# EAGLE design DTAG01 (EAGLE 4.15)
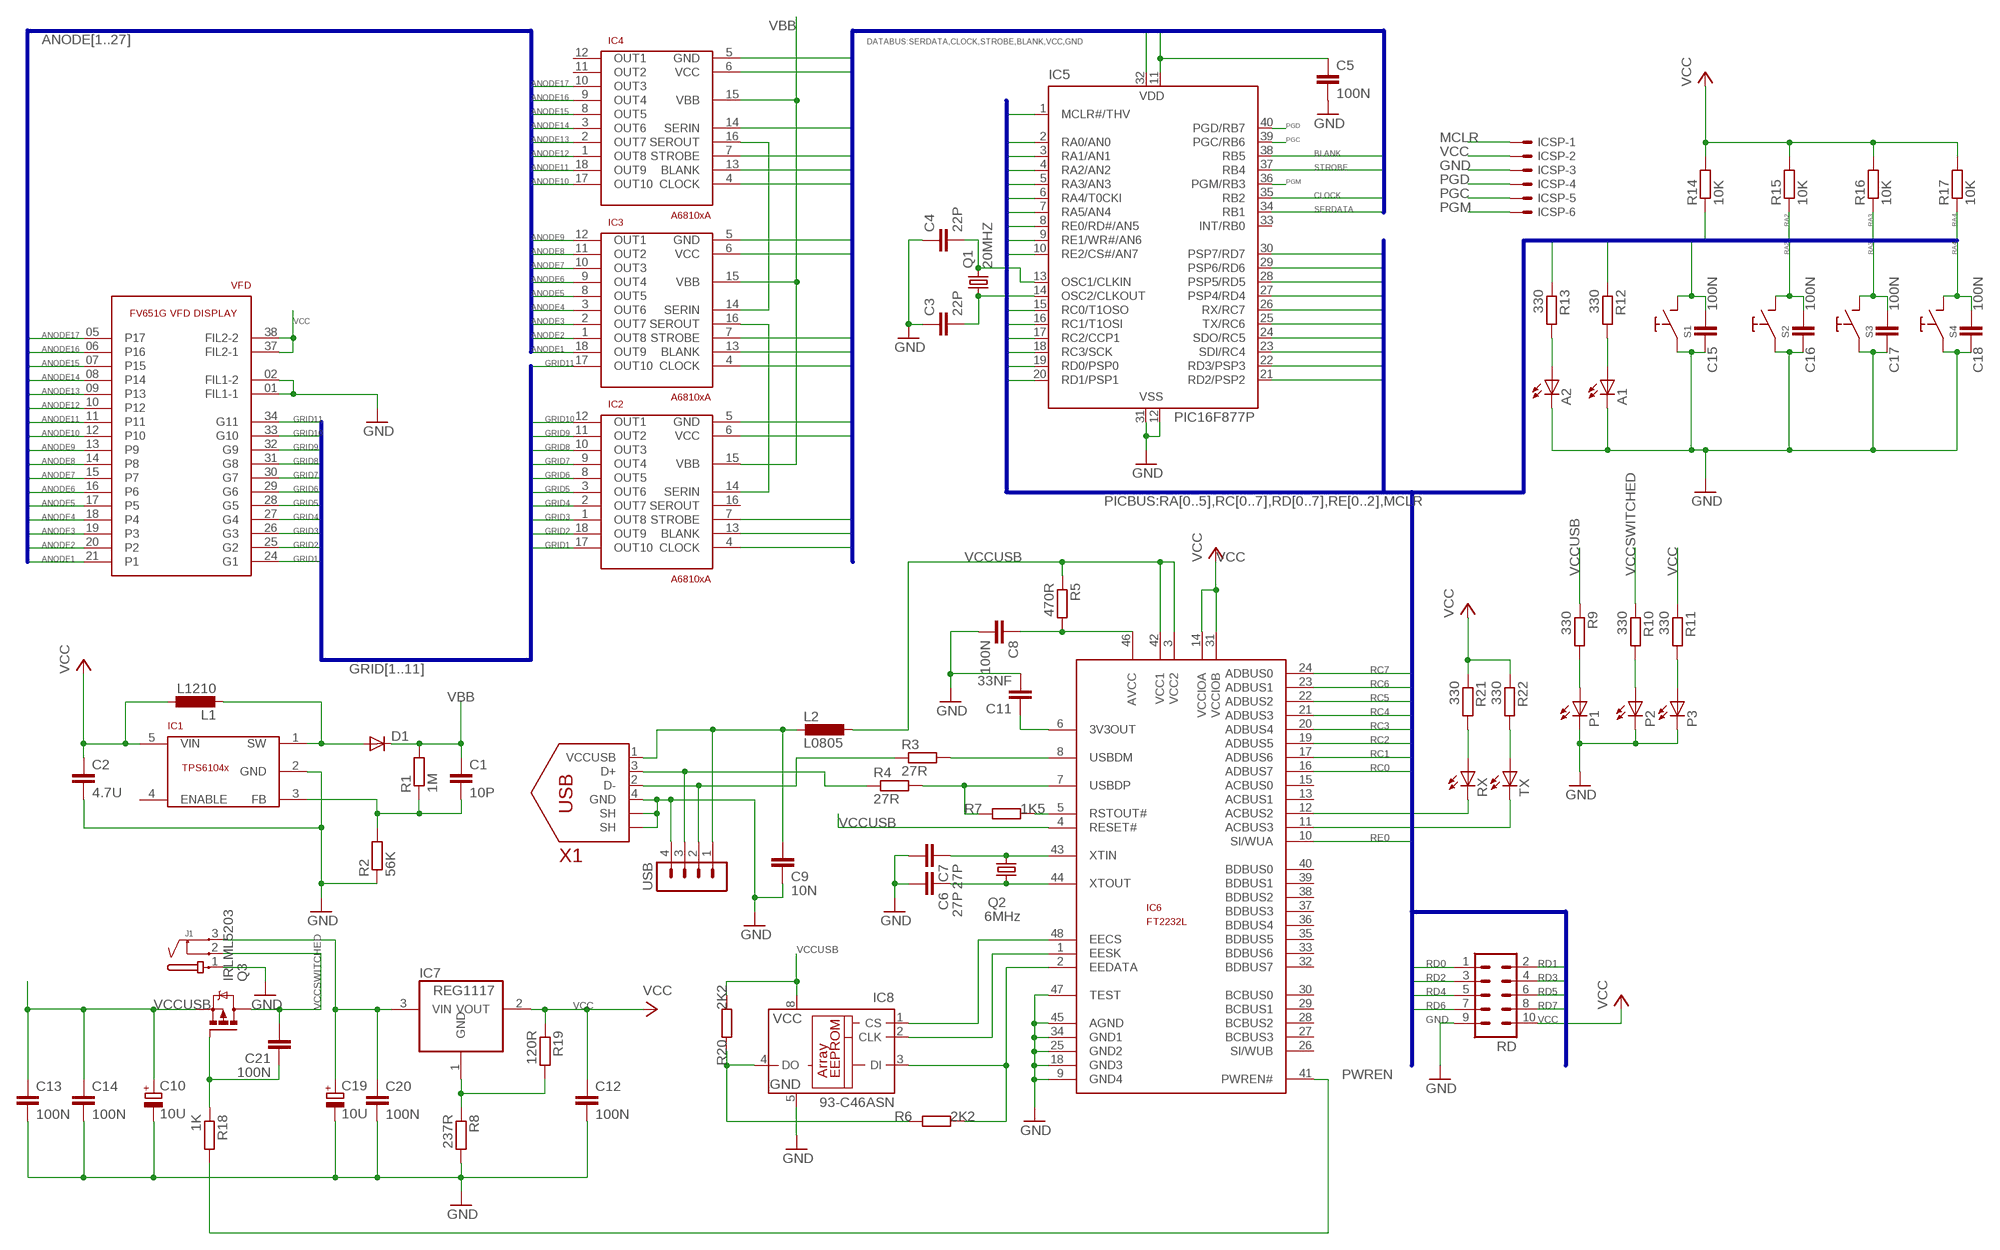
[diagram p0: schematic, sheet 1]

## Parts
A1  LEDCHIP-LED0805  [CHIP-LED0805]
A2  LEDCHIP-LED0805  [CHIP-LED0805]
C1  10P  C-EUC0805K  [C0805K]
C2  4.7U  C-EUC1210  [C1210]
C3  22P  C-EUC0805K  [C0805K]
C4  22P  C-EUC0805K  [C0805K]
C5  100N  C-EUC0805K  [C0805K]
C6  27P  C-EUC0805K  [C0805K]
C7  27P  C-EUC0805K  [C0805K]
C8  100N  C-EUC0805K  [C0805K]
C9  10N  C-EUC0805K  [C0805K]
C10  10U  CPOL-EUSMCD  [SMC_D]
C11  33NF  C-EUC0805K  [C0805K]
C12  100N  C-EUC0805K  [C0805K]
C13  100N  C-EUC0805K  [C0805K]
C14  100N  C-EUC0805K  [C0805K]
C15  100N  C-EUC0805K  [C0805K]
C16  100N  C-EUC0805K  [C0805K]
C17  100N  C-EUC0805K  [C0805K]
C18  100N  C-EUC0805K  [C0805K]
C19  10U  CPOL-EUSMCD  [SMC_D]
C20  100N  C-EUC0805K  [C0805K]
C21  100N  C-EUC0805K  [C0805K]
D1  DIODE-  [POWERMITE]
IC1  TPS6104X  [SOT23-6L]
IC2  A6810  [DIL18]
IC3  A6810  [DIL18]
IC4  A6810  [DIL18]
IC5  PIC16F877P  [DIL40]
IC6  FT2232L  [LQFP48]
IC7  REG1117  [SOT223]
IC8  93-C46ASN  [SO-08]
ICSP  53048-06  [53048-06]
J1  JACK-PMS  [JACK-PMS]
L1  L1210  [C1210]
L2  L0805  [C0805]
P1  LEDCHIP-LED0805  [CHIP-LED0805]
P2  LEDCHIP-LED0805  [CHIP-LED0805]
P3  LEDCHIP-LED0805  [CHIP-LED0805]
Q1  20MHZ  CRYTALHC49S  [HC49/S]
Q2  6MHz  CRYTALHC49S  [HC49/S]
Q3  IRLML5203  [MICRO3]
R1  1M  R-EU_R0805  [R0805]
R2  56K  R-EU_R0805  [R0805]
R3  27R  R-EU_R0805  [R0805]
R4  27R  R-EU_R0805  [R0805]
R5  470R  R-EU_R0805  [R0805]
R6  2K2  R-EU_R0805  [R0805]
R7  1K5  R-EU_R0805  [R0805]
R8  237R  R-EU_R0805  [R0805]
R9  330  R-EU_R0805  [R0805]
R10  330  R-EU_R0805  [R0805]
R11  330  R-EU_R0805  [R0805]
R12  330  R-EU_R0805  [R0805]
R13  330  R-EU_R0805  [R0805]
R14  10K  R-EU_R0805  [R0805]
R15  10K  R-EU_R0805  [R0805]
R16  10K  R-EU_R0805  [R0805]
R17  10K  R-EU_R0805  [R0805]
R18  1K  R-EU_R0805  [R0805]
R19  120R  R-EU_R0805  [R0805]
R20  2K2  R-EU_R0805  [R0805]
R21  330  R-EU_R0805  [R0805]
R22  330  R-EU_R0805  [R0805]
RD  MA05-2  [MA05-2]
RX  LEDCHIP-LED0805  [CHIP-LED0805]
S1  TASTER  [TASTER01]
S2  TASTER  [TASTER01]
S3  TASTER  [TASTER01]
S4  TASTER  [TASTER01]
TX  LEDCHIP-LED0805  [CHIP-LED0805]
USB  MA04-1  [MA04-1]
VFD  FV651G  [FV651G]
X1  USBCONN  [PN61729]

## Nets
ANODE1: IC3.18(OUT9) VFD.21(P1)
ANODE2: IC3.1(OUT8) VFD.20(P2)
ANODE3: IC3.2(OUT7) VFD.19(P3)
ANODE4: IC3.3(OUT6) VFD.18(P4)
ANODE5: IC3.8(OUT5) VFD.17(P5)
ANODE6: IC3.9(OUT4) VFD.16(P6)
ANODE7: IC3.10(OUT3) VFD.15(P7)
ANODE8: IC3.11(OUT2) VFD.14(P8)
ANODE9: IC3.12(OUT1) VFD.13(P9)
ANODE10: IC4.17(OUT10) VFD.12(P10)
ANODE11: IC4.18(OUT9) VFD.11
ANODE12: IC4.1(OUT8) VFD.10(P12)
ANODE13: IC4.2(OUT7) VFD.09(P13)
ANODE14: IC4.3(OUT6) VFD.08(P14)
ANODE15: IC4.8(OUT5) VFD.07(P15)
ANODE16: IC4.9(OUT4) VFD.06(P16)
ANODE17: IC4.10(OUT3) VFD.05(P17)
BLANK: IC2.13(BLANK) IC3.13(BLANK) IC4.13(BLANK) IC5.38(RB5)
CLOCK: IC2.4(CLOCK) IC3.4(CLOCK) IC4.4(CLOCK) IC5.35(RB2)
GND: A1.C A2.C C2.2 C3.1 C4.1 C5.2 C6.2 C7.2 C8.2 C9.1 C10.- C11.2 C12.2 C13.2 C14.2 C15.1 C16.1 C17.1 C18.1 C19.- C20.2 IC1.2(GND) IC2.5(GND) IC3.5(GND) IC4.5(GND) IC5.12(VSS) IC5.31(VSS) IC6.9(GND4) IC6.18(GND3) IC6.25(GND2) IC6.34(GND1) IC6.45(AGND) IC6.47(TEST) IC8.5(GND) ICSP.3 J1.1 P1.C P2.C P3.C R2.1 R8.2 RD.9 S1.S1 S2.S1 S3.S1 S4.S1 USB.4 VFD.01(FIL1-1) VFD.02(FIL1-2) X1.4(GND) X1.SHIELD1(SH) X1.SHIELD2(SH)
GRID1: IC2.17(OUT10) VFD.24(G1)
GRID2: IC2.18(OUT9) VFD.25(G2)
GRID3: IC2.1(OUT8) VFD.26(G3)
GRID4: IC2.2(OUT7) VFD.27(G4)
GRID5: IC2.3(OUT6) VFD.28(G5)
GRID6: IC2.8(OUT5) VFD.29(G6)
GRID7: IC2.9(OUT4) VFD.30(G7)
GRID8: IC2.10(OUT3) VFD.31(G8)
GRID9: IC2.11(OUT2) VFD.32(G9)
GRID10: IC2.12(OUT1) VFD.33(G10)
GRID11: IC3.17(OUT10) VFD.34(G11)
MCLR: C15.2 IC5.1(MCLR#/THV) ICSP.1 R14.1 S1.S2
N$1: IC3.14(SERIN) IC4.16(SEROUT)
N$2: IC2.14(SERIN) IC3.16(SEROUT)
N$3: C4.2 IC5.13(OSC1/CLKIN) Q1.2
N$4: C3.2 IC5.14(OSC2/CLKOUT) Q1.1
N$5: IC6.1(EESK) IC8.2(CLK)
N$6: R4.1 USB.3 X1.3(D+)
N$7: R3.1 USB.2 X1.2(D-)
N$8: IC6.8(USBDM) R3.2
N$9: IC6.7(USBDP) R4.2 R7.1
N$10: IC6.5(RSTOUT#) R7.2
N$11: C7.1 IC6.43(XTIN) Q2.2
N$12: C6.1 IC6.44(XTOUT) Q2.1
N$13: C8.1 IC6.46(AVCC) R5.2
N$14: C21.1 Q3.1(G) R18.1
N$15: C9.2 L2.2 USB.1 X1.1(VCCUSB)
N$16: IC7.1(GND) R8.1 R19.2
N$17: D1.P$1(A) IC1.1(SW) L1.2
N$18: C11.1 IC6.6(3V3OUT)
N$19: A2.A R13.2
N$20: C1.2 IC1.3(FB) R1.1 R2.2
N$21: A1.A R12.2
N$22: P2.A R10.2
N$23: C19.+ C20.1 IC7.3(VIN) J1.3
N$25: P1.A R9.2
N$26: P3.A R11.2
N$27: IC6.48(EECS) IC8.1(CS)
N$28: IC6.2(EEDATA) IC8.3(DI) R6.2
N$29: IC8.4(DO) R6.1 R20.1
N$30: R21.2 RX.A
N$31: R22.2 TX.A
N$32: IC6.12(ACBUS2) RX.C
PGC: IC5.39(PGC/RB6) ICSP.5
PGD: IC5.40(PGD/RB7) ICSP.4
PGM: IC5.36(PGM/RB3) ICSP.6
PWREN: IC6.41(PWREN#) R18.2
RA0: IC5.2(RA0/AN0) R13.1
RA1: IC5.3(RA1/AN1) R12.1
RA2: C16.2 IC5.4(RA2/AN2) R15.1 S2.S2
RA3: C17.2 IC5.5(RA3/AN3) R16.1 S3.S2
RA4: C18.2 IC5.6(RA4/T0CKI) R17.1 S4.S2
RA5: IC5.7(RA5/AN4)
RC0: IC5.15(RC0/T1OSO) IC6.16(ADBUS7)
RC1: IC5.16(RC1/T1OSI) IC6.17(ADBUS6)
RC2: IC5.17(RC2/CCP1) IC6.19(ADBUS5)
RC3: IC5.18(RC3/SCK) IC6.20(ADBUS4)
RC4: IC5.23(SDI/RC4) IC6.21(ADBUS3)
RC5: IC5.24(SDO/RC5) IC6.22(ADBUS2)
RC6: IC5.25(TX/RC6) IC6.23(ADBUS1)
RC7: IC5.26(RX/RC7) IC6.24(ADBUS0)
RD0: IC5.19(RD0/PSP0) RD.1
RD1: IC5.20(RD1/PSP1) RD.2
RD2: IC5.21(RD2/PSP2) RD.3
RD3: IC5.22(RD3/PSP3) RD.4
RD4: IC5.27(PSP4/RD4) RD.5
RD5: IC5.28(PSP5/RD5) RD.6
RD6: IC5.29(PSP6/RD6) RD.7
RD7: IC5.30(PSP7/RD7) RD.8
RE0: IC5.8(RE0/RD#/AN5) IC6.10(SI/WUA)
RE1: IC5.9(RE1/WR#/AN6)
RE2: IC5.10(RE2/CS#/AN7)
SERDATA: IC4.14(SERIN) IC5.34(RB1)
STROBE: IC2.7(STROBE) IC3.7(STROBE) IC4.7(STROBE) IC5.37(RB4)
TX: IC6.11(ACBUS3) TX.C
VBB: C1.1 D1.P$2(C) IC2.15(VBB) IC3.15(VBB) IC4.15(VBB) R1.2
VCC: C2.1 C5.1 C12.1 IC1.5(VIN) IC2.6(VCC) IC3.6(VCC) IC4.6(VCC) IC5.11(VDD) IC5.32(VDD) IC6.14(VCCIOA) IC6.31(VCCIOB) IC7.2(VOUT) ICSP.2 L1.1 R11.1 R14.2 R15.2 R16.2 R17.2 R19.1 R21.1 R22.1 RD.10 VFD.37(FIL2-1) VFD.38(FIL2-2)
VCCSWITCHED: C21.2 J1.2 Q3.3(D) R10.1
VCCUSB: C10.+ C13.1 C14.1 IC6.3(VCC2) IC6.4(RESET#) IC6.42(VCC1) IC8.8(VCC) L2.1 Q3.2(S) R5.1 R9.1 R20.2
Unconnected: IC1.4(ENABLE) IC2.16(SEROUT) IC4.11(OUT2) IC4.12(OUT1) IC5.33(INT/RB0) IC6.13(ACBUS1) IC6.15(ACBUS0) IC6.26(SI/WUB) IC6.27(BCBUS3) IC6.28(BCBUS2) IC6.29(BCBUS1) IC6.30(BCBUS0) IC6.32(BDBUS7) IC6.33(BDBUS6) IC6.35(BDBUS5) IC6.36(BDBUS4) IC6.37(BDBUS3) IC6.38(BDBUS2) IC6.39(BDBUS1) IC6.40(BDBUS0)

## Buses
GRID[1..11]
ANODE[1..27]
DATABUS:SERDATA,CLOCK,STROBE,BLANK,VCC,GND
PICBUS:RA[0..5],RC[0..7],RD[0..7],RE[0..2],MCLR

## Library data of the parts
A1 A2 P1-P3 RX TX = led:LED: LED OSRAM: - CHIPLED LG R971, LG N971, LY N971, LG Q971, LY Q971, LO R971, LY R971 LH N974, LH R974 LS Q976, LO Q976, LY Q976 LO Q996 - Hyper CHIPLED LW Q18S LB Q993, LB Q99A, LB R99A - SideLED LS A670, LO A670, LY A670, LG A670, LP A670 LB A673, LV A673, LT A673, LW A673 LH A674 LY A675 LS A676, LA A676, LO A676, LY A676, LW A676 LS A679, LY A679, LG A679 - Hyper Micro SIDELED® LS Y876, LA Y876, LO Y876, LY Y876 LT Y87S - SmartLED LW L88C, LW L88S LB L89C, LB L89S, LG L890 LS L89K, LO L89K, LY L89K LS L896, LA L896, LO L896, LY L896 - TOPLED LS T670, LO T670, LY T670, LG T670, LP T670 LSG T670, LSP T670, LSY T670, LOP T670, LYG T670 LG T671, LOG T671, LSG T671 LB T673, LV T673, LT T673, LW T673 LH T674 LS T676, LA T676, LO T676, LY T676, LB T676, LH T676, LSB T676, LW T676 LB T67C, LV T67C, LT T67C, LS T67K, LO T67K, LY T67K, LW E67C LS E67B, LA E67B, LO E67B, LY E67B, LB E67C, LV E67C, LT E67C LW T67C LS T679, LY T679, LG T679 LS T770, LO T770, LY T770, LG T770, LP T770 LB T773, LV T773, LT T773, LW T773 LH T774 LS E675, LA E675, LY E675, LS T675 LS T776, LA T776, LO T776, LY T776, LB T776 LHGB T686 LT T68C, LB T68C - Hyper Mini TOPLED® LB M676 - Mini TOPLED Santana® LG M470 LS M47K, LO M47K, LY M47K Source: http://www.osram.convergy.de/
C1 C3-C9 C11-C18 C20 C21 = rcl:C-EU: CAPACITOR, European symbol
C2 = turbod3:C-EU: CAPACITOR, European symbol
C10 C19 = rcl:CPOL-EU: POLARIZED CAPACITOR, European symbol
D1 = diode:DIODE-: DIODE
IC1 = turbod3:TPS6104X
IC2-IC4 = turbod3:A6810
IC5 = microchip:PIC16F87*: MICROCONTROLLER
IC6 = turbod3:FT2232L
IC7 = burr-brown:REG1117: 800mA and 1A Low Dropout (LDO) Positive Regulator 1.8V, 2.5V, 2.85V, 3.3V, 5V, and Adj
IC8 = microchip:93-*: Serial EEPROM 512 x 8 bit/256 x 16 bit/1 K/4 K, 5.0 V, Microwire
ICSP = con-molex:53?-06: CONNECTOR wire to board 1.25 mm (.049 inch) pitch header
J1 = POWER-IN:JACK-PMS
L1 L2 = turbod3:L
Q1 Q2 = turbod3:CRYTAL: CRYSTAL
Q3 = transistor-power:IRLML5203: HEXFET P-Channel Power MOSFET
R1-R22 = rcl:R-EU_: RESISTOR, European symbol
RD = con-lstb:MA05-2: PIN HEADER
S1-S4 = turbod3:TASTER
USB = con-lstb:MA04-1: PIN HEADER
VFD = turbod3:FV651G
X1 = turbod3:USBCONN

## Net classes
0 default: width 0.25 mm, drill 0.006 mm

## Board
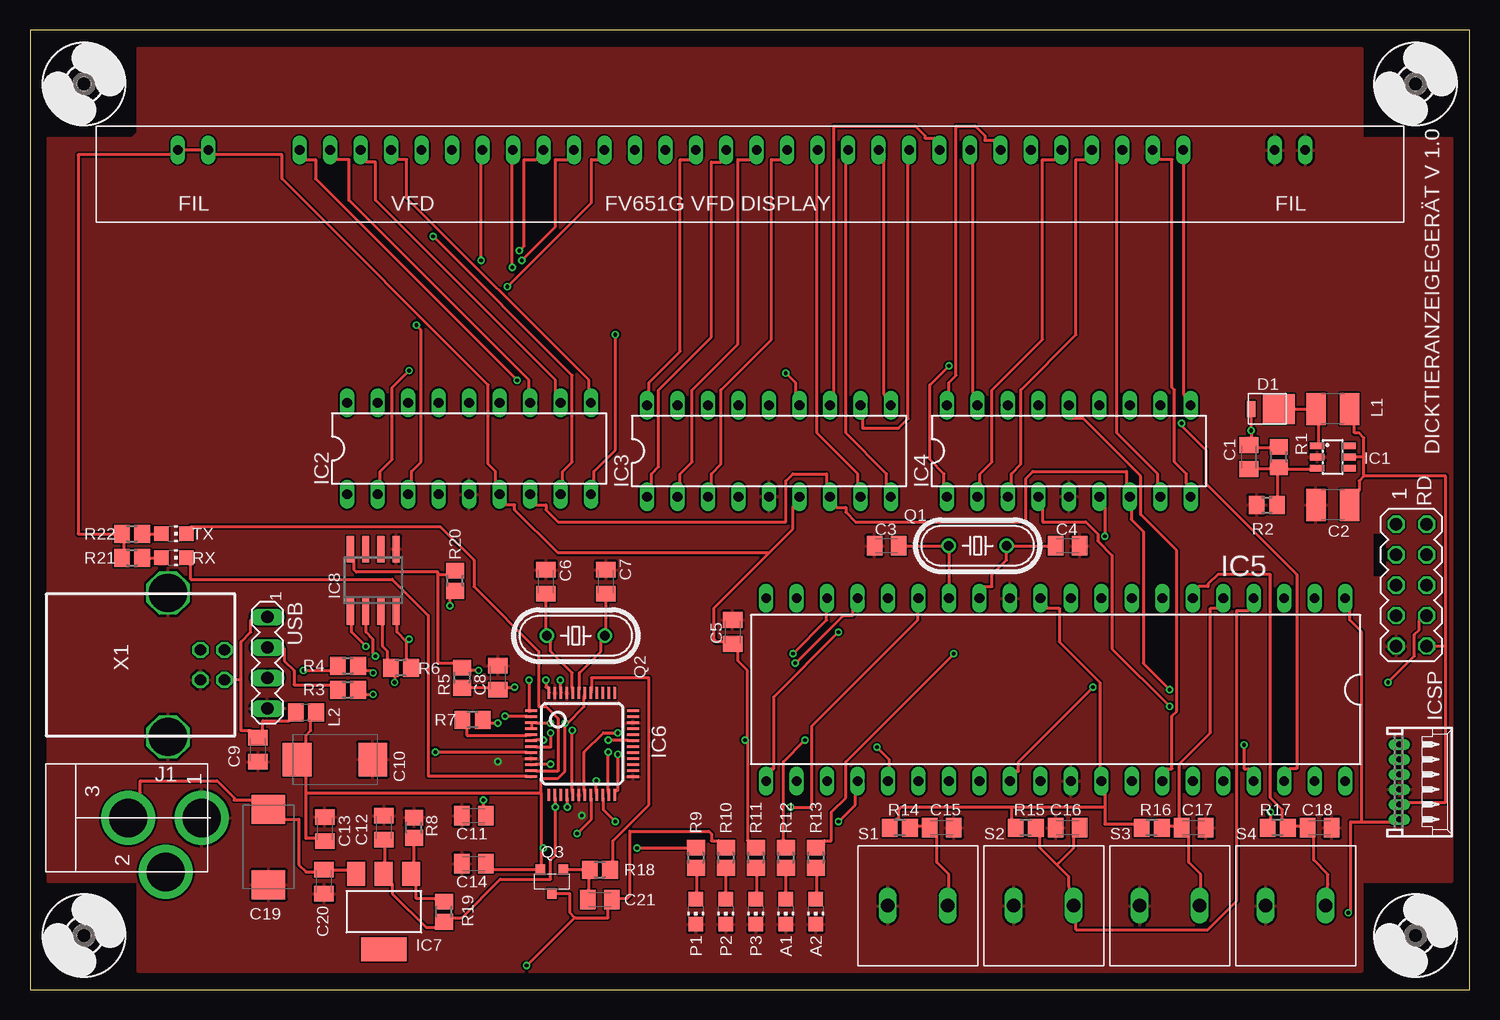
[diagram p1: board, top side]
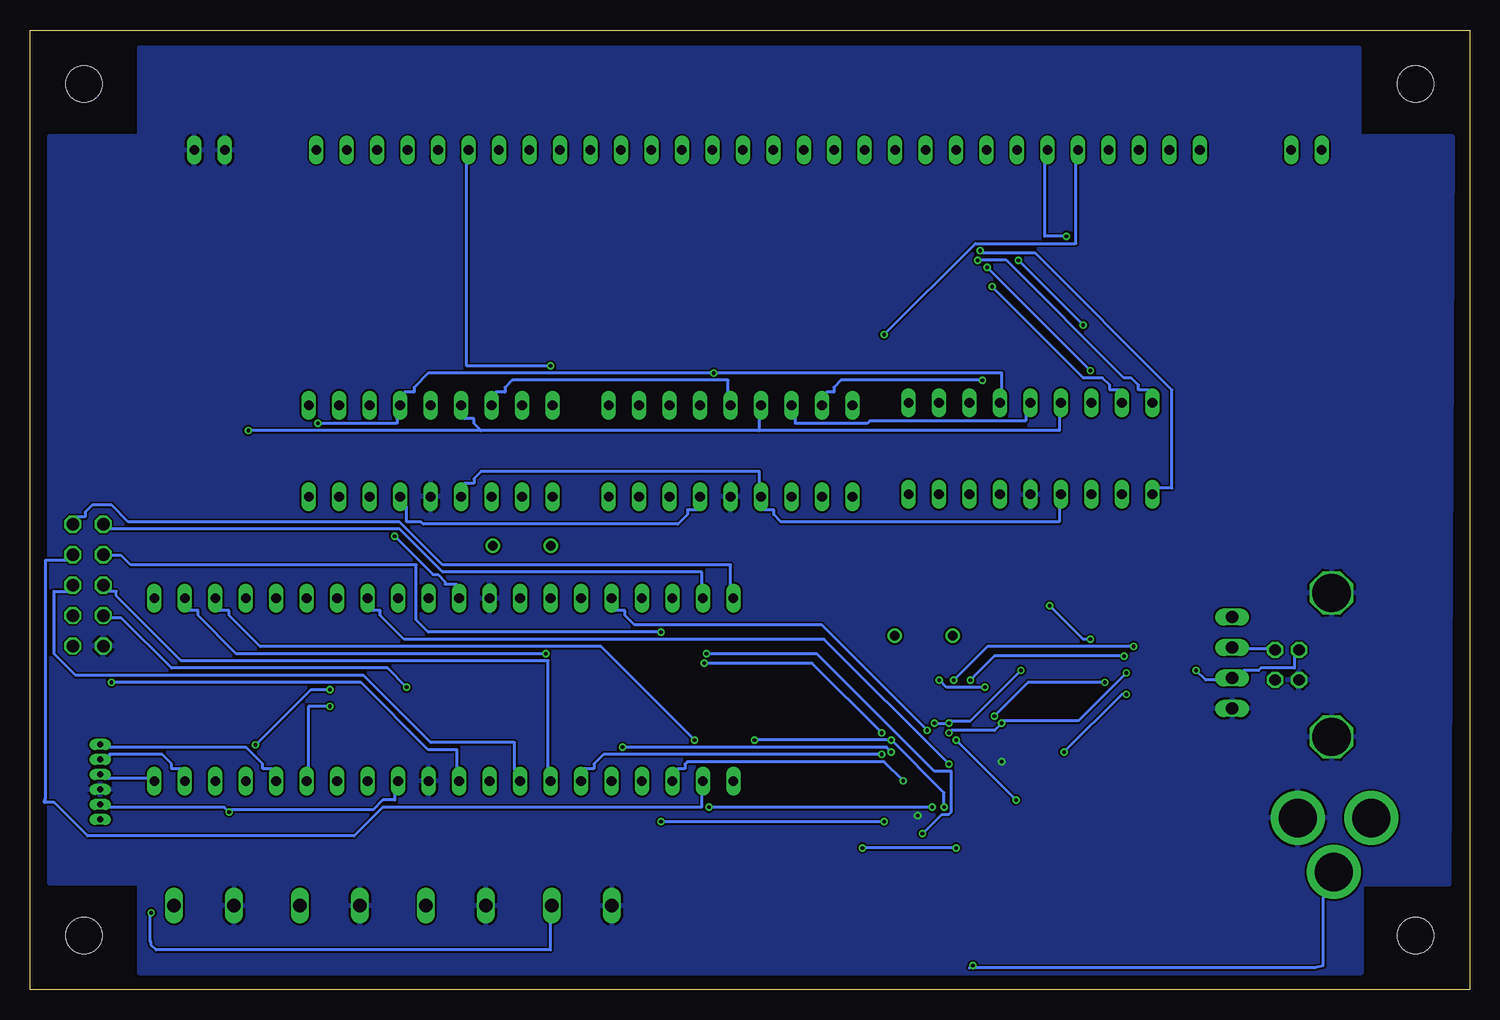
[diagram p2: board, bottom side, seen from below]

Size 120 x 80 mm. Coordinates in mm from the lower left corner, seen from the top.
Outline: 0,0 120,0 120,80 0,80 0,0
Copper layers (1*16): Top 0.035mm / dielectric 1.5mm / Bottom 0.035mm
Design rules "PCB-POOL": minimum track width 6mil, minimum drill 12mil, track to track 6mil, track to pad 6mil, pad to pad 6mil, via to via 6mil, smd to smd 6mil, copper to edge 20mil, drill to drill 8mil, minimum pad ring 8mil, minimum via ring 6mil, stop-mask expansion 3mil, vias tented up to drill 0mil, thermal gap 8mil
tRestrict: area 112,34.5 to 113,38

### Footprints (pad centres in the part's own frame; a part is rotated, then mirrored left to right if it is on the bottom)
CHIP-LED0805 = smd 1.2 x 1.2: A 0,-1.05; C 0,1.05
C0805K = smd 1.3 x 1.6: 1 -1,0; 2 1,0
C1210 = smd 1.6 x 2.7: 1 -1.4,0; 2 1.4,0
SMC_D = smd 2.4 x 2.8: + -3.15,0; - 3.15,0
POWERMITE = smd 2.7 x 2.5: P$1 0,0 | smd 0.7 x 1.3: P$2 2.3,0
SOT23-6L = smd 0.55 x 1.2: 1 -0.95,-1.3; 2 0,-1.3; 3 0.95,-1.3; 4 0.95,1.3; 5 0,1.3; 6 -0.95,1.3
DIL18 = drill 0.813 long: 1 -10.16,-3.81; 2 -7.62,-3.81; 3 -5.08,-3.81; 4 -2.54,-3.81; 5 0,-3.81; 6 2.54,-3.81; 7 5.08,-3.81; 8 7.62,-3.81; 9 10.16,-3.81; 10 10.16,3.81; 11 7.62,3.81; 12 5.08,3.81; 13 2.54,3.81; 14 0,3.81; 15 -2.54,3.81; 16 -5.08,3.81; 17 -7.62,3.81; 18 -10.16,3.81
DIL40 = drill 0.813 long: 1 -24.13,-7.62; 2 -21.59,-7.62; 3 -19.05,-7.62; 4 -16.51,-7.62; 5 -13.97,-7.62; 6 -11.43,-7.62; 7 -8.89,-7.62; 8 -6.35,-7.62; 9 -3.81,-7.62; 10 -1.27,-7.62; 11 1.27,-7.62; 12 3.81,-7.62; 13 6.35,-7.62; 14 8.89,-7.62; 15 11.43,-7.62; 16 13.97,-7.62; 17 16.51,-7.62; 18 19.05,-7.62; 19 21.59,-7.62; 20 24.13,-7.62; 21 24.13,7.62; 22 21.59,7.62; 23 19.05,7.62; 24 16.51,7.62; 25 13.97,7.62; 26 11.43,7.62; 27 8.89,7.62; 28 6.35,7.62; 29 3.81,7.62; 30 1.27,7.62; 31 -1.27,7.62; 32 -3.81,7.62; 33 -6.35,7.62; 34 -8.89,7.62; 35 -11.43,7.62; 36 -13.97,7.62; 37 -16.51,7.62; 38 -19.05,7.62; 39 -21.59,7.62; 40 -24.13,7.62
LQFP48 = smd 0.2 x 1: 1 -2.75,-4.25; 2 -2.25,-4.25; 3 -1.75,-4.25; 4 -1.25,-4.25; 5 -0.75,-4.25; 6 -0.25,-4.25; 7 0.25,-4.25; 8 0.75,-4.25; 9 1.25,-4.25; 10 1.75,-4.25; 11 2.25,-4.25; 12 2.75,-4.25; 25 2.75,4.25; 26 2.25,4.25; 27 1.75,4.25; 28 1.25,4.25; 29 0.75,4.25; 30 0.25,4.25; 31 -0.25,4.25; 32 -0.75,4.25; 33 -1.25,4.25; 34 -1.75,4.25; 35 -2.25,4.25; 36 -2.75,4.25 | smd 1 x 0.2: 13 4.25,-2.75; 14 4.25,-2.25; 15 4.25,-1.75; 16 4.25,-1.25; 17 4.25,-0.75; 18 4.25,-0.25; 19 4.25,0.25; 20 4.25,0.75; 21 4.25,1.25; 22 4.25,1.75; 23 4.25,2.25; 24 4.25,2.75; 37 -4.25,2.75; 38 -4.25,2.25; 39 -4.25,1.75; 40 -4.25,1.25; 41 -4.25,0.75; 42 -4.25,0.25; 43 -4.25,-0.25; 44 -4.25,-0.75; 45 -4.25,-1.25; 46 -4.25,-1.75; 47 -4.25,-2.25; 48 -4.25,-2.75
SOT223 = smd 1.499 x 2.007: 1 -2.261,-3.15; 2 0.025,-3.15; 3 2.311,-3.15 | smd 3.81 x 2.007: 4 0,3.15
SO-08 = smd 0.6 x 2.2: 1 -1.905,-2.6; 2 -0.635,-2.6; 3 0.635,-2.6; 4 1.905,-2.6; 5 1.905,2.6; 6 0.635,2.6; 7 -0.635,2.6; 8 -1.905,2.6
53048-06 = drill 0.5 pad 0.698 long: 1 3.125,-1.25; 2 1.875,-1.25; 3 0.625,-1.25; 4 -0.625,-1.25; 5 -1.875,-1.25; 6 -3.125,-1.25
JACK-PMS = drill 3.2 pad 4.5 round: 1 -0.5,-3.31; 2 -5,-0.31; 3 -0.5,2.809
C0805 = smd 1.3 x 1.5: 1 -0.85,0; 2 0.85,0
HC49/S = drill 0.813 round: 1 -2.413,0; 2 2.413,0
MICRO3 = smd 0.8 x 0.9: 1 -0.95,-1; 2 0.95,-1; 3 0,1
R0805 = smd 1.3 x 1.5: 1 -0.85,0; 2 0.85,0
MA05-2 = drill 1.016 octagon: 1 -5.08,-1.27; 2 -5.08,1.27; 3 -2.54,-1.27; 4 -2.54,1.27; 5 0,-1.27; 6 0,1.27; 7 2.54,-1.27; 8 2.54,1.27; 9 5.08,-1.27; 10 5.08,1.27
TASTER01 = drill 1.1 long: S1 -2.5,0; S2 2.5,0
3,0 = hole 3: 0,0
MA04-1 = drill 1.016 long: 1 -3.81,0; 2 -1.27,0; 3 1.27,0; 4 3.81,0
FV651G = drill 0.8 long: 01 50.8,0; 02 48.26,0; 05 40.64,0; 06 38.1,0; 07 35.56,0; 08 33.02,0; 09 30.48,0; 10 27.94,0; 11 25.4,0; 12 22.86,0; 13 20.32,0; 14 17.78,0; 15 15.24,0; 16 12.7,0; 17 10.16,0; 18 7.62,0; 19 5.08,0; 20 2.54,0; 21 0,0; 22 -2.54,0; 23 -5.08,0; 24 -7.62,0; 25 -10.16,0; 26 -12.7,0; 27 -15.24,0; 28 -17.78,0; 29 -20.32,0; 30 -22.86,0; 31 -25.4,0; 32 -27.94,0; 33 -30.48,0; 34 -33.02,0; 37 -40.64,0; 38 -43.18,0
PN61729 = drill 0.95 octagon: 1 1.25,4.71; 2 -1.25,4.71; 3 -1.25,2.71; 4 1.25,2.71 | drill 3.2 octagon: SHIELD1 -6,0; SHIELD2 6,0

### Placement (x,y rotation side)
A1  63,6.5 180 top
A2  65.5,6.5 180 top
C1  101.6,44.4 270 top
C2  108.6,40.4 180 top
C3  71.4,37 0 top
C4  86.5,37 180 top
C5  58.58,29.81 90 top
C6  43,34 90 top
C7  48,34 90 top
C8  39,26 90 top
C9  19,20 90 top
C10  25.43,19.18 0 top
C11  37,14.5 180 top
C12  29.5,13.5 90 top
C13  24.58,13.39 90 top
C14  37,10.5 180 top
C15  76,13.5 180 top
C16  86.5,13.5 0 top
C17  97,13.5 180 top
C18  107.5,13.5 180 top
C19  19.88,11.88 270 top
C20  24.5,9 270 top
C21  47.5,7.5 0 top
D1  104.1,48.4 180 top
IC1  108.6,44.4 270 top
IC2  36.6,45.1 0 top
IC3  61.6,44.9 0 top
IC4  86.6,44.9 0 top
IC5  85.5,25 180 top
IC6  46,20.5 270 top
IC7  29.5,6.5 180 top
IC8  28.62,34.11 0 top
ICSP  115.4,17.3 270 top
J1  11,14.8 90 top
L1  108.6,48.4 180 top
L2  23,23.1 180 top
P1  55.5,6.5 180 top
P2  58,6.5 180 top
P3  60.5,6.5 180 top
Q1  79,37 0 top
Q2  45.5,29.5 0 top
Q3  43.5,9 180 top
R1  104.1,44.4 90 top
R2  103.1,40.4 0 top
R3  26.5,25 0 top
R4  26.5,27 0 top
R5  36,26 270 top
R6  30.92,26.82 180 top
R7  36.9,22.5 180 top
R8  32,13.5 90 top
R9  55.5,11 270 top
R10  58,11 270 top
R11  60.5,11 270 top
R12  63,11 270 top
R13  65.5,11 270 top
R14  72.5,13.5 180 top
R15  83,13.5 180 top
R16  93.5,13.5 180 top
R17  104,13.5 180 top
R18  47.5,10 0 top
R19  34.5,6.5 90 top
R20  35.44,34.08 90 top
R21  8.5,36 0 top
R22  8.5,38 0 top
RD  115.15,33.71 270 top
RX  12,36 270 top
S1  74,7 0 top
S2  84.5,7 0 top
S3  95,7 0 top
S4  105.5,7 0 top
TX  12,38 270 top
U$1  [3,0]  4.5,75.5 0 top
U$2  [3,0]  115.5,75.5 0 top
U$4  [3,0]  115.5,4.5 0 top
U$5  [3,0]  4.5,4.5 0 top
USB  19.79,27.24 270 top
VFD  55.5,70 0 top
X1  11.5,27.06 270 top

### Tracks (layer width: path | path; a pad name or v marks a point on that pad's centre or on a via)
ANODE1
  Top 0.25: VFD.21 55,69.2 54.2,69.2 54.2,53.2 51.6,50.6 51.6,49.8 IC3.18
ANODE2
  Top 0.25: VFD.20 57.6,69 56.8,69 56.8,54.4 52.4,50 52.4,43.6 51.8,43 51.8,42.2 IC3.1
ANODE3
  Top 0.25: VFD.19 60,69.2 59,69.2 59,53.8 55.2,50 55.2,44 54.2,43 54.2,42.2 IC3.2
ANODE4
  Top 0.25: VFD.18 62.6,69.2 61.8,69.2 61.8,54.2 57.6,50 57.6,43.8 56.8,43 56.8,42.2 IC3.3
ANODE5
  Top 0.25: VFD.17 65.6,68.8 65.6,46.4 69,43 69,42.2 IC3.8
ANODE6
  Top 0.25: VFD.16 68,68.8 68,46.4 71.4,43 71.4,42.2 IC3.9
ANODE7
  Top 0.25: VFD.15 71.2,69.2 71.2,49.6 IC3.10
ANODE8
  Top 0.25: VFD.14 73.2,68.8 73.2,47.6 72.4,46.8 69.4,46.8 69.4,47.6 IC3.11
ANODE9
  Top 0.25: VFD.13 75.4,71 74.6,71 74.6,71.2 73.8,72 67,72 67,49.8 IC3.12
ANODE10
  Top 0.25: VFD.12 78.6,68.8 78.6,49.8 IC4.17
ANODE11
  Top 0.25: VFD.11 80.4,70.8 79.6,70.8 79.6,71.2 78.8,72 77.2,72 77.2,51.2 76.6,50.6 76.6,49.8 IC4.18
ANODE12  (via drill 0.3)
  Top 0.25: v76.6,52 75,50.4 75,44.2 76.2,43 76.2,42.2 IC4.1
  Bottom 0.25: v76.6,52 83.6,52 83.6,68.8 VFD.10
ANODE13
  Top 0.25: VFD.09 85.4,69.2 84.4,69.2 84.4,54.2 80.2,50 80.2,44 79.2,43 79.2,42.2 IC4.2
ANODE14
  Top 0.25: VFD.08 88,69.2 87.2,69.2 87.2,54.6 82.6,50 82.6,43.8 81.8,43 81.8,42.2 IC4.3
ANODE15
  Top 0.25: VFD.07 90.6,69.2 90.6,46.4 94,43 94,42.2 IC4.8
ANODE16
  Top 0.25: VFD.06 94.2,69.2 95.2,69.2 95.2,50.2 95.4,50 95.4,44 96.4,43 96.4,42.2 IC4.9
ANODE17
  Top 0.25: VFD.05 96.2,68.8 96.2,49.6 IC4.10
BLANK  (via drill 0.3)
  Top 0.25: v63,51.4 63.8,50.6 63.8,49.8 IC3.13 | v96,47.2 96,47 98,45 98,42.2 105.6,34.6 105.6,18.4 105,18.4 IC5.38
  Bottom 0.25: IC2.13 39,50 39,51.4 v63,51.4 86.8,51.4 88,50.2 88,49.8 88.8,49.8 IC4.13 89.4,47.6 89.4,47.2 v96,47.2
CLOCK  (via drill 0.3)
  Top 0.25: v95,23.6 90.2,28.4 90.2,36.2 89,37.4 89,38 88,39 84.4,39 84.4,40 IC4.4
  Bottom 0.25: IC2.4 34.2,40.2 34.2,39 57.4,39 58,39.6 58,40 58.8,40 IC3.4 59.2,42.2 59.2,43.2 82.4,43.2 83,42.6 83,42.2 83.8,42.2 IC4.4 | v95,23.6 96.8,23.6 96.8,18.4 IC5.35
GND  (via drill 0.3)
  other vias: 39,19 46,14.5
  pour Top: 1.5,71 8.5,71 9,71.5 9,78.5 111,78.5 111,71 118.5,71 118.5,9 111,9 111,1.5 9,1.5 9,9 1.5,9
  pour Bottom: 9.2,71.1 9.2,78.5 110.9,78.5 110.9,71.1 118.4,71.1 118.4,8.9 110.9,8.9 110.9,1.4 9,1.4 9,8.8 1.7,8.8 1.4,70.8 1.4,71.1
GRID1  (via drill 0.3)
  Top 0.25: v39.8,58.6 46.8,65.6 46.8,69.2 47.4,69.2 VFD.24
  Bottom 0.25: v39.8,58.6 32.2,51 30.6,51 30,50.4 30,50 29.2,50 IC2.17
GRID2  (via drill 0.3)
  Top 0.25: v41,60.8 43.8,63.6 43.8,69.2 44.8,69.2 VFD.25
  Bottom 0.25: v41,60.8 38.6,60.8 28.8,51 28.2,51 27.6,50.4 27.6,50 26.8,50 IC2.18
GRID3  (via drill 0.3)
  Top 0.25: v40.8,61.6 41.2,62 41.2,69.2 42.2,69.2 VFD.26
  Bottom 0.25: v40.8,61.6 40.6,61.4 36.2,61.4 24.8,50 24.8,41.8 26,41.8 IC2.1
GRID4  (via drill 0.3)
  Top 0.25: v40.2,60.2 40.2,68.8 VFD.27 | v31.6,51.6 30.2,50.2 30.2,44.2 29.2,43.2 29.2,42.4 IC2.2
  Bottom 0.25: v31.6,51.6 v40.2,60.2
GRID5  (via drill 0.3)
  Top 0.25: v37.6,60.8 37.6,68.8 VFD.28 | v32.2,55.4 32.6,55 32.6,44 31.8,43.2 31.8,42.4 IC2.3
  Bottom 0.25: v32.2,55.4 v37.6,60.8
GRID6  (via drill 0.3)
  Top 0.25: v33.6,62.8 45.2,51.2 45.2,44 44.4,43.2 44.4,42.4 IC2.8
  Bottom 0.25: v33.6,62.8 35.4,62.8 35.4,68.8 VFD.29
GRID7  (via drill 0.3)
  Top 0.25: v48.8,54.6 48.8,45 47,43.2 47,42.4 IC2.9
  Bottom 0.25: v48.8,54.6 41.2,62.2 32.8,62.2 32.8,68.8 VFD.30
GRID8
  Top 0.25: VFD.31 30.6,69.2 31.4,69.2 31.4,66 46.6,50.8 46.6,50 IC2.10
GRID9
  Top 0.25: VFD.32 28,69 28.8,69 28.8,65.8 43.8,50.8 43.8,49.8 IC2.11
GRID10
  Top 0.25: VFD.33 25.6,69.2 26.6,69.2 26.6,65.8 41.6,50.8 41.6,50 IC2.12
GRID11  (via drill 0.3)
  Top 0.25: v40.6,50.8 23.8,67.6 23.8,69.2 23,69.2 VFD.34
  Bottom 0.25: v40.6,50.8 52.4,50.8 53,50.2 53,49.8 53.6,49.8 IC3.17
MCLR  (via drill 0.3)
  Top 0.25: R14.1 73.8,13.6 74.4,13.6 C15.2 75.6,12.8 75.6,10.6 76.6,9.6 76.6,8.8 S1.S2 | 110.1,14 111,14 111,29.8 110,30.8 110,31.6 IC5.1 | 110.1,14 113.4,14 ICSP.1 | v109.9,6.4 110.1,6.6 110.1,14
  Bottom 0.25: v109.9,6.4 110,6.4 110,4 109.9,4 109.9,3.7 109.5,3.3 76.6,3.3 76.6,6 S1.S2
N$1
  Bottom 0.25: IC3.14 61.8,49.8 61.8,50.8 79.8,50.8 80.4,50.2 80.4,49.8 81.2,49.8 IC4.16
N$2
  Bottom 0.25: IC2.14 37,48 37,47.4 50,47.4 50.2,47.2 56.2,47.2 56.2,47.6 IC3.16
N$3
  Top 0.25: C4.2 Q1.2 81.4,36.4 81.4,35.8 80.2,34.6 80.2,33.6 79.6,33.6 IC5.13
N$4
  Top 0.25: C3.2 Q1.1 76.6,36.4 76.6,33.8 IC5.14
N$5  (via drill 0.3)
  Top 0.25: v41.6,25.8 41.6,23.2 IC6.1 | v28.8,27.8 28.6,28 28.6,29.2 28,29.8 28,30.6 IC8.2
  Bottom 0.25: v41.6,25.8 39.6,27.8 v28.8,27.8
N$6  (via drill 0.3)
  Top 0.25: v22.8,26.6 25.2,26.6 R4.1
  Bottom 0.25: v22.8,26.6 22,25.8 21.2,25.8 USB.3 18.8,26.6 17.6,26.6 17.4,26.8 14.6,26.8 14.6,27.8 X1.3
N$7
  Top 0.25: R3.1 25.2,25.4 22,25.4 22,26.6 21.2,27.4 21.2,28.4 USB.2
  Bottom 0.25: X1.2 16.8,28.4 18.4,28.4 USB.2
N$8  (via drill 0.3)
  Top 0.25: v33.8,19.8 41.4,19.8 IC6.8 | v28.6,24.6 27.8,24.6 R3.2
  Bottom 0.25: v33.8,19.8 29,24.6 v28.6,24.6
N$9  (via drill 0.3)
  Top 0.25: v43.4,21.4 43.4,20.2 42.2,20.2 IC6.7 | v39,22.2 38.2,22.2 R7.1 | v28.6,26.4 28.6,26.6 27.8,26.6 R4.2
  Bottom 0.25: v43.4,21.4 43.2,21.6 39.6,21.6 v39,22.2 38.8,22.4 32.6,22.4 v28.6,26.4
N$10
  Top 0.25: IC6.5 41.4,21.2 36.4,21.2 36.4,21.8 R7.2
N$11
  Top 0.25: IC6.43 45.8,25.2 45.8,26.4 47.6,28.2 47.6,29 Q2.2 48,30 C7.1
N$12
  Top 0.25: IC6.44 45.2,25.2 45.2,26.4 43.4,28.2 43.4,29 Q2.1 43,30 C6.1
N$13  (via drill 0.3)
  Top 0.25: v44.2,25.8 44.2,25.2 IC6.46 | v40.4,25.2 39.6,25.2 C8.1 38.4,25.2 36.6,25.2 R5.2
  Bottom 0.25: v44.2,25.8 43.6,25.2 v40.4,25.2
N$14
  Top 0.25: Q3.1 R18.1 46.6,9.4 46.6,8.2 C21.1
N$15
  Top 0.25: L2.2 21.6,22.4 19.4,22.4 19.4,21.6 C9.2 18.4,21.6 17.6,21.6 17.6,25.8 | 17.6,25.8 16.8,25.8 X1.1 | 17.6,25.8 17.6,29 18.4,29.8 18.4,30.8 USB.1
N$16
  Top 0.25: R19.2 33.8,7.6 32.2,7.6 32.2,8.8 IC7.1 32,10.6 R8.1
N$17
  Top 0.25: IC1.1 107.4,45.6 107.4,47.2 L1.2 D1.P$1
N$18  (via drill 0.3)
  Top 0.25: v42.8,20.8 42.2,20.8 IC6.6 | v37.8,15.8 37.8,15.2 C11.1
  Bottom 0.25: v37.8,15.8 v42.8,20.8
N$19
  Top 0.25: A2.A 65.6,8 65.6,9.6 R13.2
N$20
  Top 0.25: IC1.3 106.8,43.4 104.8,43.4 R1.1 | R2.2 104,41 104,43 R1.1 | C1.2 103.4,43.4 R1.1
N$21
  Top 0.25: A1.A R12.2
N$22
  Top 0.25: P2.A R10.2
N$23
  Top 0.25: IC7.3 26.6,10 C20.1 23.8,9.8 23,9.8 22.4,10.4 22.4,14.2 21.2,14.2 C19.+ 18.6,15.8 17,15.8 17,16 15.6,17.4 9.2,17.4 9.2,16.4 J1.3
N$25
  Top 0.25: P1.A 55.6,8 55.6,9.6 R9.2
N$26
  Top 0.25: P3.A 60.6,8 60.6,9.6 R11.2
N$27  (via drill 0.3)
  Top 0.25: v43,25.8 43,25.2 43.2,25.2 IC6.48 | v28,28.6 26.8,29.8 26.8,30.6 IC8.1
  Bottom 0.25: v43,25.8 40.2,28.6 v28,28.6
N$28  (via drill 0.3)
  Top 0.25: v39.6,22.8 41.4,22.8 IC6.2 | v30.4,25.6 30.4,26.2 R6.2 29.8,27.4 29.8,28.2 29.4,28.6 29.4,30.6 IC8.3
  Bottom 0.25: v39.6,22.8 36.8,25.6 v30.4,25.6
N$29  (via drill 0.3)
  Top 0.25: 31.4,29 31.4,27.4 R6.1 | 31.4,29 30.6,29.8 30.6,30.6 IC8.4 | v35,32 35,32.6 R20.1 | 31.4,29 v31.6,29.2
  Bottom 0.25: v35,32 32.2,29.2 v31.6,29.2
N$30
  Top 0.25: R21.2 RX.A
N$31
  Top 0.25: R22.2 TX.A
N$32
  Top 0.25: IC6.12 41.4,17.8 33.2,17.8 33.2,31.2 30.2,34.2 13.4,34.2 13.4,35.6 RX.C
PGC
  Bottom 0.25: ICSP.5 113.4,19.4 113.4,19.6 109,19.6 108.2,18.8 108.2,18.4 107.4,18.4 IC5.39
PGD
  Bottom 0.25: ICSP.4 113.4,17.6 110.2,17.6 IC5.40
PGM
  Bottom 0.25: ICSP.6 113.4,20.2 102,20.2 100.6,18.8 100.6,18.4 99.8,18.4 IC5.36
PWREN
  Top 0.25: IC6.41 46.8,25.2 46.8,26 51.6,26 51.6,15.4 48.6,12.4 48.6,10.6 R18.2
RA0  (via drill 0.3)
  Top 0.25: v77,28 68,19 68,16 66.8,14.8 66.8,12.4 66.2,12.4 R13.1
  Bottom 0.25: v77,28 102.8,28 106,31.2 106,31.6 106.8,31.6 IC5.2
RA1  (via drill 0.3)
  Top 0.25: v64.6,20.8 62.8,19 62.8,12.4 R12.1
  Bottom 0.25: v64.6,20.8 72.4,28.6 100.8,28.6 103.4,31.2 103.4,31.6 104.2,31.6 IC5.3
RA2
  Top 0.25: 85.6,10.4 86.6,9.4 86.6,8.6 S2.S2 87.2,6 87.2,5 98.2,5 100.6,7.4 100.6,31.6 101.6,31.6 IC5.4 | 85.6,10.4 84.2,11.8 84.2,12.8 R15.1 | 85.6,10.4 87,11.8 87,12.8 C16.2
RA3
  Top 0.25: R16.1 94.8,13.6 95.4,13.6 C17.2 | C17.2 96.6,12.8 96.6,10.6 97.6,9.6 97.6,8.8 S3.S2 | IC5.5 99,31.8 98.4,31.8 98.4,21.4 95.8,18.8 95.8,14.2 C17.2
RA4
  Top 0.25: S4.S2 108.2,8.8 108.2,9.6 107,10.8 107,12.8 C18.2 106,13.6 105.4,13.6 R17.1 104.4,14.2 104.4,15 103.4,16 103.4,34.6 99,34.6 98.2,33.8 98.2,33.6 97.4,33.6 IC5.6
RC0  (via drill 0.3)
  Top 0.25: v44.8,15.2 44.8,15.8 IC6.16 | v63.4,15.2 65.2,15.2 65.2,22 74,30.8 74,31.6 IC5.15
  Bottom 0.25: v44.8,15.2 v63.4,15.2
RC1  (via drill 0.3)
  Top 0.25: v45.2,21.6 45.2,16.6 IC6.17
  Bottom 0.25: v45.2,21.6 54,30.4 69.6,30.4 70.4,31.2 70.4,31.6 71.2,31.6 IC5.16
RC2  (via drill 0.3)
  Top 0.25: v49,21.4 47.8,21.4 46.2,19.8 46.2,16.6 IC6.19 | v63.8,27.2 67.8,31.2 68.6,31.2 68.6,31.6 IC5.17
  Bottom 0.25: v49,21.4 54.8,27.2 v63.8,27.2
RC3  (via drill 0.3)
  Top 0.25: v45.6,13 46.8,14.2 46.8,15.8 IC6.20 | v63.6,28 66.4,30.8 66.4,31.6 IC5.18
  Bottom 0.25: v45.6,13 44,14.6 43.4,14.6 43.2,14.8 43.2,18.2 44.6,18.2 54.4,28 v63.6,28
RC4  (via drill 0.3)
  Top 0.25: v47.2,17.4 47.2,16.6 IC6.21
  Bottom 0.25: v47.2,17.4 48.8,19 65.2,19 65.4,18.8 65.4,18.4 66,18.4 IC5.23
RC5  (via drill 0.3)
  Top 0.25: v48.8,14 47.8,15 47.8,15.8 IC6.22 | v67.4,14 68.8,15.4 68.8,16.2 IC5.24
  Bottom 0.25: v48.8,14 v67.4,14
RC6  (via drill 0.3)
  Top 0.25: v48.2,19.8 48.2,16.6 IC6.23 | v70.6,20.2 71.6,19.2 71.6,18.4 IC5.25
  Bottom 0.25: v48.2,19.8 48.6,20.2 v70.6,20.2
RC7  (via drill 0.3)
  Top 0.25: v49,19.6 49,16.6 48.8,16.6 IC6.24
  Bottom 0.25: v49,19.6 72.2,19.6 73,18.8 73,18.4 73.8,18.4 IC5.26
RD0
  Bottom 0.25: IC5.19 64,33.8 64,34.8 85.6,34.8 89.2,38.4 113.4,38.4 RD.1
RD1
  Bottom 0.25: IC5.20 61.6,33.8 61.6,35.4 85.6,35.4 89.2,39 111.8,39 113.2,40.4 114.8,40.4 115.4,39.8 115.4,39.4 116.2,39.4 RD.2
RD2  (via drill 0.3)
  Top 0.25: v67.4,29.8 62,24.4 62,18.4 61.8,18.4 IC5.21
  Bottom 0.25: v67.4,29.8 86.8,29.8 87.8,30.8 87.8,35.4 111.6,35.4 112.4,36.2 113.2,36.2 RD.3
RD3
  Bottom 0.25: IC5.22 64,16.2 64,15.2 90.6,15.2 93,12.8 115.2,12.8 118,15.6 118.8,15.6 118.7,16 118.7,35.8 116.8,35.8 RD.4
RD4
  Bottom 0.25: IC5.27 76.8,18.4 76.8,27.4 107.4,27.4 112.8,32.8 112.8,33.2 113.4,33.2 RD.5
RD5
  Bottom 0.25: IC5.28 79.6,18.4 79.6,20.6 86.6,20.6 92.2,26.2 116.2,26.2 118,28 118,33.2 116.8,33.2 RD.6
RD6  (via drill 0.3)
  Top 0.25: v88.6,25.2 82.4,19 82.4,18.2 82.2,18.2 IC5.29
  Bottom 0.25: v88.6,25.2 90.2,26.8 108.2,26.8 112.4,31 113.2,31 RD.7
RD7  (via drill 0.3)
  Top 0.25: v113.2,25.6 115.4,27.8 115.4,29.6 115.8,30 115.8,30.8 RD.8
  Bottom 0.25: v113.2,25.6 92.4,25.6 86.8,20 84.4,20 84.4,18.4 IC5.30
RE0  (via drill 0.3)
  Top 0.25: v43.4,18.8 42.2,18.8 IC6.10
  Bottom 0.25: v43.4,18.8 53.8,29.2 88.8,29.2 90.8,31.2 90.8,31.6 91.4,31.6 IC5.8
SERDATA
  Top 0.25: IC5.34 94.8,18.4 95.2,18.4 95.2,22.8 95.6,23.2 95.6,36.6 92.6,39.6 92.6,42.8 87.8,47.6 86.8,47.6 IC4.14
STROBE  (via drill 0.3)
  Top 0.25: v101.2,20.4 101.2,18.4 101.6,18.4 IC5.37 | v95,25 92.8,27.2 92.8,38.2 91.8,39.2 91.8,40 IC4.7 91.4,42.2 91.4,43.2 83.6,43.2 83,42.6 83,39 68.8,39 68,39.8 68,40.2 67.2,40.2 IC3.7 66.4,42.2 66.4,43 63.6,43 63,42.4 63,39 44,39 43,40 43,40.4 42.2,40.4 IC2.7
  Bottom 0.25: v101.2,20.4 96.6,25 v95,25
TX
  Top 0.25: IC6.11 42.2,18.2 44,18.2 44,22.6 43,23.6 42.4,23.6 42.4,28.2 37,33.6 37,35.8 34.2,38.6 13.4,38.6 13.4,38.4 TX.C
VBB  (via drill 0.3)
  Top 0.25: D1.P$2 v101.8,46.6 101.8,46 C1.1 102.2,45.2 103.4,45.2 R1.2
  Bottom 0.25: 59.2,46.6 59.2,47.6 IC3.15 | 59.2,46.6 82.4,46.6 | 82.4,46.6 83,47.2 83,47.6 83.8,47.6 IC4.15 | 59.2,46.6 34.2,46.6 34.2,47.8 IC2.15 | 82.4,46.6 v101.8,46.6
VCC  (via drill 0.3)
  Top 0.25: 81.8,15.2 72.6,15.2 72.4,15 72.4,14.2 72.2,14.2 R14.2 | 81.8,15.2 81.8,14.2 R15.2 | 89.6,15.2 89.6,16.2 IC5.32 89.2,18.4 89.2,25.6 85.8,29 85.8,31.8 84.8,31.8 IC5.11 | 89.6,15.2 89.6,13.8 92.2,13.8 R16.2 | v89.6,37.8 89.6,40.2 IC4.6 | 89.6,15.2 81.8,15.2 | 111.2,44.4 111.2,46 110.8,46.4 110.4,46.4 110.4,47.2 L1.1 | 111.2,44.4 IC1.5 | 111.2,42.8 110.8,42.4 110.8,41.6 110.6,41.6 C2.1 | 111.2,42.8 111.2,44.4 | v103.4,14.8 103.4,14.2 R17.2 | 118,28.6 117,28.6 RD.10 | 118,28.6 118,15.6 115,15.6 ICSP.2 | 111.2,42.8 118,42.8 118,28.6 | R21.1 7.8,36.6 7.8,37.4 R22.1 4,38 4,69.6 11.8,69.6 VFD.38 VFD.37 15.4,69.6 21,69.6 21,67.6 38.2,50.4 38.2,43.8 38.8,43.2 38.8,42.4 IC2.6 39.6,40.4 40.4,40.4 40.4,40 44,36.4 61.6,36.4 | C12.1 29.6,12 29.6,10.6 IC7.2 30.2,8.8 30.2,8 33,5.2 33.8,5.2 R19.1 35.2,6 36,6 39.2,9.2 43.4,9.2 43.4,10.8 43.8,11.2 v43.8,15.2 43.8,15.8 IC6.14 | v48.2,20.8 49.8,20.8 IC6.31 | 59.8,20.8 59.8,26.6 59,27.4 59,28.2 C5.1 57.8,29 57.2,29 57,29.2 57,31.8 61.6,36.4 | 59.8,20.8 59.8,12.4 R11.1 | 61.6,36.4 63.6,38.4 63.6,40.2 IC3.6 | v59.6,20.8 59.8,20.8
  Bottom 0.25: v89.6,37.8 86.4,34.6 86,34.6 85.4,34 85.4,33.8 84.4,33.8 IC5.11 | ICSP.2 113.4,15.2 103.8,15.2 v103.4,14.8 103.2,15 91.4,15 90.6,15.8 89.6,15.8 89.6,16.2 IC5.32 | v43.8,15.2 43.8,16.4 v48.2,20.8 v59.6,20.8 | IC4.6 88.6,40.2 88.6,39 87.4,39 87.2,38.8 66,38.8 65.2,39.6 65.2,40 64.4,40 IC3.6
VCCSWITCHED  (via drill 0.3)
  Top 0.25: 45.4,6 45,6.4 45,8 Q3.3 | 45.4,6 48.2,6 48.2,6.8 C21.2 49,7.6 49.8,7.6 50,7.8 50,13.2 56.6,13.2 56.8,13 56.8,12.4 57.4,12.4 R10.1 | v41.4,2 45.4,6
  Bottom 0.25: v41.4,2 41.7,1.8 12.9,1.8 12.2,2 12.2,7.6 J1.2
VCCUSB  (via drill 0.3)
  Top 0.25: 34,34.6 34,27.2 35.4,27.2 R5.1 36.6,26.6 v37.4,26.6 | 34,34.6 34.8,34.6 R20.2 | 34,34.6 34,34.8 27.2,34.8 27,35 27,35.8 IC8.8 | L2.1 23.4,22.4 23.4,21.6 23,21.2 23,20.4 C10.+ 23,17.8 23,16.4 | 23,16.4 23,12.6 23.8,12.6 C13.1 | IC6.4 41.8,21.8 41.8,22.2 IC6.3 42.2,22.2 v43.4,22.2 | C14.1 38.6,10 Q3.2 42.6,10.4 42.6,11.8 | 44.8,22.2 44.6,22 44.6,18.2 44,17.6 42.6,17.6 42.6,16.4 | 44.8,22.2 46.2,23.6 46.2,24.4 IC6.42 | 42.6,16.4 42.6,11.8 | 44.8,22.2 v44.6,22.2 | v50.6,11.8 54.8,11.8 R9.1 | 42.6,11.8 v42.8,11.8 | 23,16.4 42.6,16.4
  Bottom 0.25: v44.6,22.2 v43.4,22.2 43.2,22.4 41.6,22.4 v37.4,26.6 | v42.8,11.8 v50.6,11.8

### Text on the board
tNames: DICKTIERANZEIGEGERÄT V 1.0